# EAGLE design PulseSensorRing (EAGLE 7.3.0)
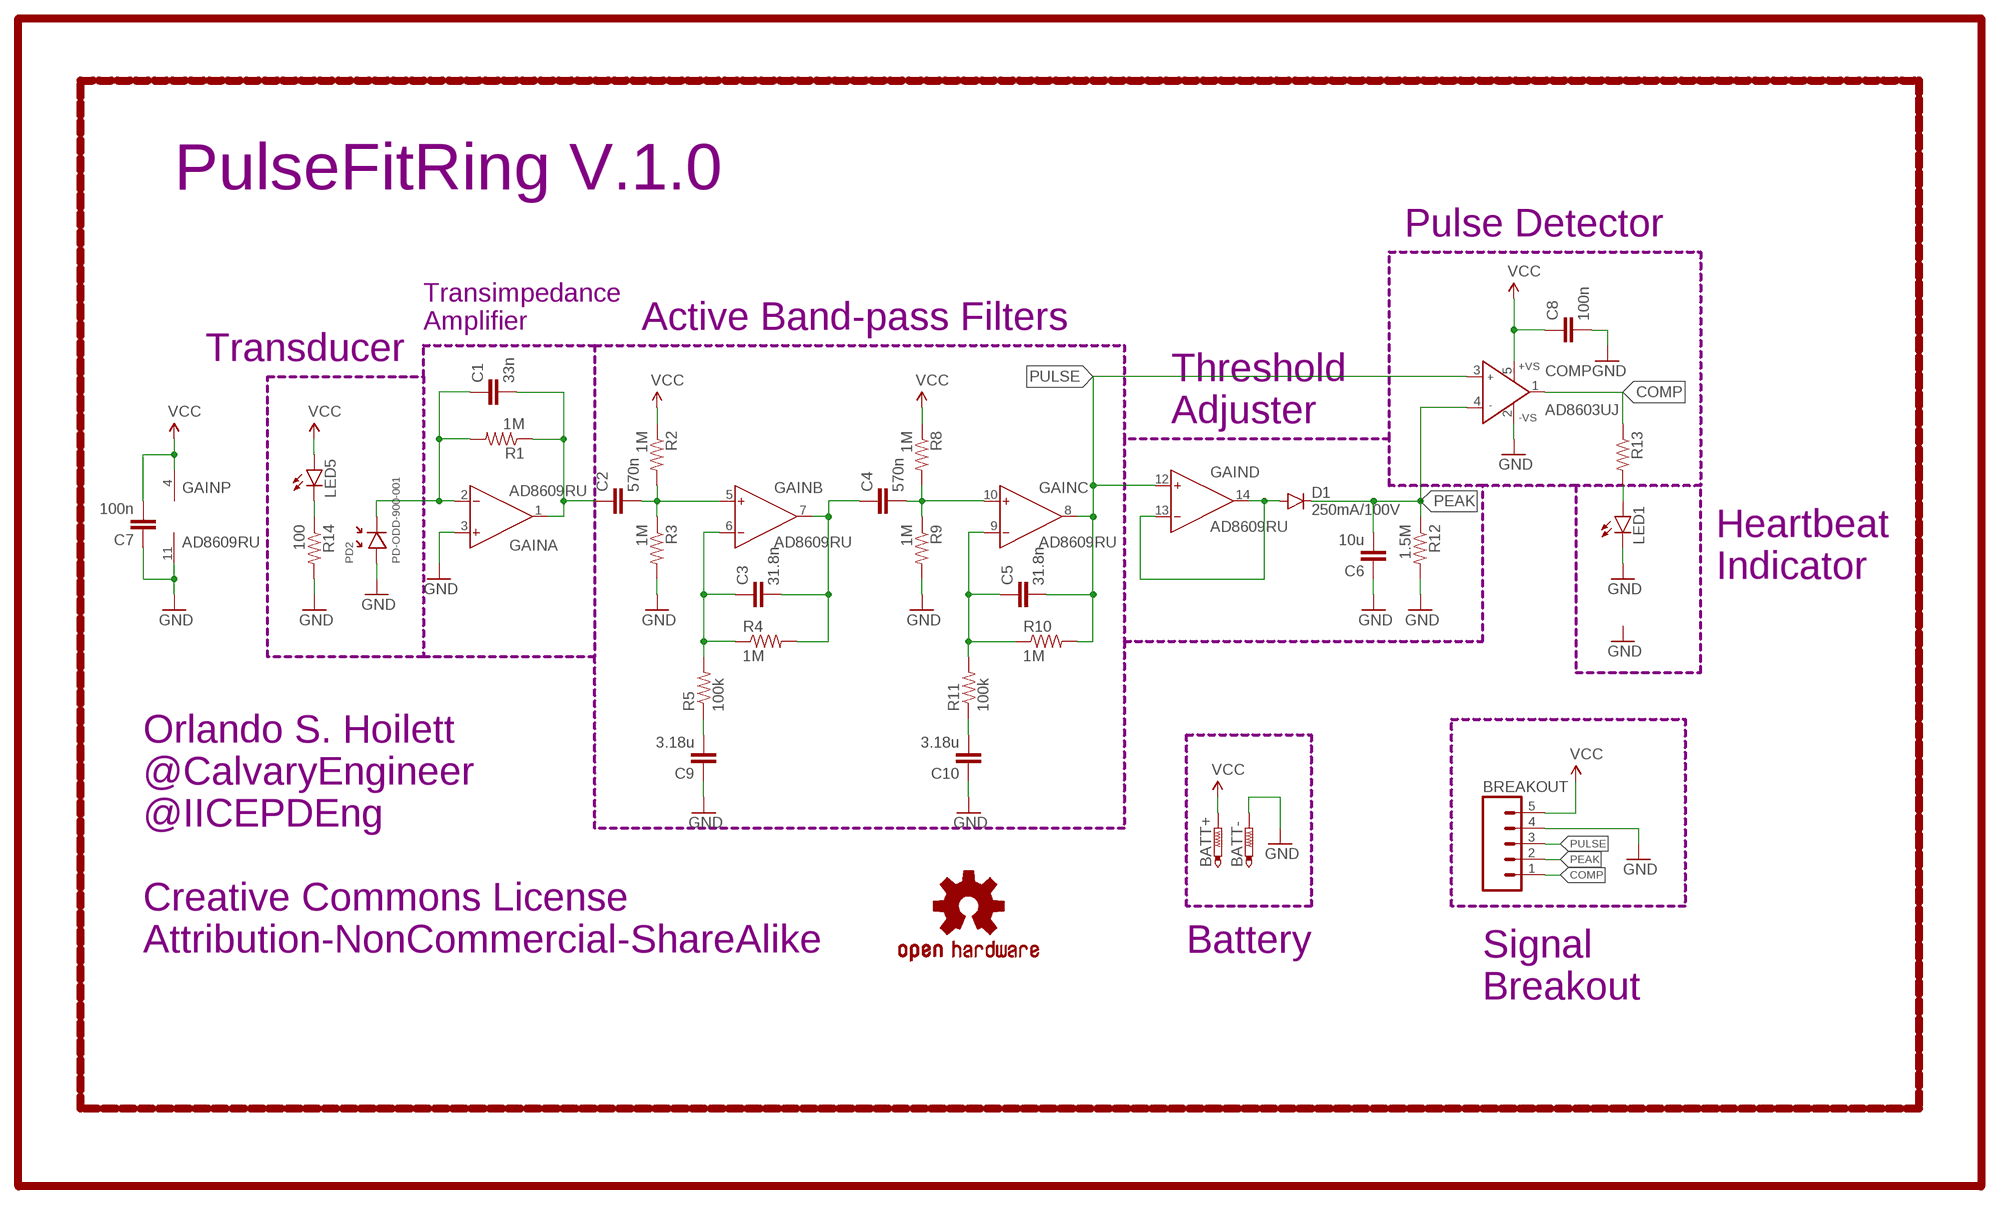
[diagram p0: schematic, sheet 1]

## Parts
BATT  BATT-CONNECT  [HOLE]
BREAKOUT  M05NO_SILK  [1X05_NO_SILK]
C1  33n  C-EUC0402  [C0402]
C2  570n  C-EUC0402  [C0402]
C3  31.8n  C-EUC0402  [C0402]
C4  570n  C-EUC0402  [C0402]
C5  31.8n  C-EUC0402  [C0402]
C6  10u  C-EUC0402  [C0402]
C7  100n  C-EUC0402  [C0402]
C8  100n  C-EUC0402  [C0402]
C9  3.18u  C-EUC0402  [C0402]
C10  3.18u  C-EUC0402  [C0402]
COMP  AD8603UJ  [SOT23-5]
D1  250mA/100V  DIODEBAS16  [SOD-323]
GAIN  AD8609RU  [TSSOP14]
LED1  LED0603  [LED-0603]
LED5  LED0603  [LED-0603]
LOGO1  OSHW-LOGOS  [OSHW-LOGO-S]
PD2  PD-ODD-900-001  [SMD-PD-01]
R1  1M  R-US_R0402  [R0402]
R2  1M  R-US_R0402  [R0402]
R3  1M  R-US_R0402  [R0402]
R4  1M  R-US_R0402  [R0402]
R5  100k  R-US_R0402  [R0402]
R8  1M  R-US_R0402  [R0402]
R9  1M  R-US_R0402  [R0402]
R10  1M  R-US_R0402  [R0402]
R11  100k  R-US_R0402  [R0402]
R12  1.5M  R-US_R0402  [R0402]
R13  R-US_R0402  [R0402]
R14  100  R-US_R0402  [R0402]

## Nets
COMP: BREAKOUT.1 COMP.1(OUT) R13.1
GND: BATT.P$2 BREAKOUT.4 C6.1 C7.1 C8.2 C9.1 C10.1 COMP.2(-VS) GAIN.3(A:IN+) GAIN.11(P:V-) LED1.C PD2.ANODE(+) R3.2 R9.2 R12.2 R14.2
N$1: C1.1 GAIN.2(A:IN-) PD2.CATHODE(-) R1.2
N$2: C1.2 C2.1 GAIN.1(A:OUT) R1.1
N$3: C4.2 GAIN.10(C:IN+) R8.2 R9.1
N$4: C2.2 GAIN.5(B:IN+) R2.2 R3.1
N$5: C3.1 GAIN.6(B:IN-) R4.1 R5.2
N$6: C3.2 C4.1 GAIN.7(B:OUT) R4.2
N$7: C9.2 R5.1
N$8: C5.1 GAIN.9(C:IN-) R10.1 R11.2
N$9: LED5.C R14.1
N$10: D1.A GAIN.13(D:IN-) GAIN.14(D:OUT)
N$11: C10.2 R11.1
N$13: LED1.A R13.2
PEAK: BREAKOUT.2 C6.2 COMP.4(IN-) D1.C R12.1
PULSE: BREAKOUT.3 C5.2 COMP.3(IN+) GAIN.8(C:OUT) GAIN.12(D:IN+) R10.2
VCC: BATT.P$1 BREAKOUT.5 C7.2 C8.1 COMP.5(+VS) GAIN.4(P:V+) LED5.A R2.1 R8.1

## Notes on the sheet
- PulseFitRing V.1.0
- Pulse Detector
- Transimpedance
  Amplifier
- Active Band-pass Filters
- Transducer
- Threshold
  Adjuster
- Heartbeat
  Indicator
- Orlando S. Hoilett
  @CalvaryEngineer
  @IICEPDEng
  
  Creative Commons License
  Attribution-NonCommercial-ShareAlike
- Battery
- Signal
  Breakout

## Library data of the parts
BATT = OrlandoRonMod:BATT-CONNECT
BREAKOUT = SparkFun-Connectors:M05: Header 5 Standard 5-pin 0.1" header. Use with straight break away headers (SKU : PRT-00116), right angle break away headers (PRT-00553), swiss pins (PRT-00743), machine pins (PRT-00117), and female headers (PRT-00115). Molex polarized connector foot print use with SKU : PRT-08230 with associated crimp pins and housings.
C1-C10 = resistor:C-EU: CAPACITOR, European symbol
COMP = analog-devices:AD8603: Precision Micropower, Low Noise CMOS, Rail-to-Rail Input/Output Operational Amplifiers Source: http://www.analog.com/static/imported-files/data_sheets/AD8603_8607_8609.pdf; MF: ALTERA CORPORATION; MPN: AD8603AUJZ-REEL7; OC_FARNELL: 1651290; OC_NEWARK: 59K6904
D1 = SparkFun-DiscreteSemi:DIODE: Diode These are standard reverse protection diodes and small signal diodes. SMA package can handle up to about 1A. SOD-323 can handle about 200mA. What the SOD-323 package when ordering, there are some mfgs out there that are 5-pin packages.; PROD_ID: DIO-09646
GAIN = analog-devices:AD8609: Precision Micropower, Low Noise CMOS, Rail-to-Rail Input/Output Operational Amplifiers Source: http://www.analog.com/static/imported-files/data_sheets/AD8603_8607_8609.pdf; MF: ALTERA CORPORATION; MPN: AD8609ARUZ; OC_FARNELL: 1464994; OC_NEWARK: 59K6934
LED1 LED5 = SparkFun-LED:LED: LEDs Standard schematic elements and footprints for 5mm, 3mm, 1206, and 0603 sized LEDs. 5mm - Spark Fun Electronics SKU : COM-00529 (and others)
LOGO1 = SparkFun-Aesthetics:OSHW-LOGO: Open Source Hardware Logo This logo indicates the piece of hardware it is found on incorporates a OSHW license and/or adheres to the definition of open source hardware found here: http://freedomdefined.org/OSHW
PD2 = Orlando:PD-ODD-900-001
R1-R5 R8-R14 = resistor:R-US_: RESISTOR, American symbol

## Board
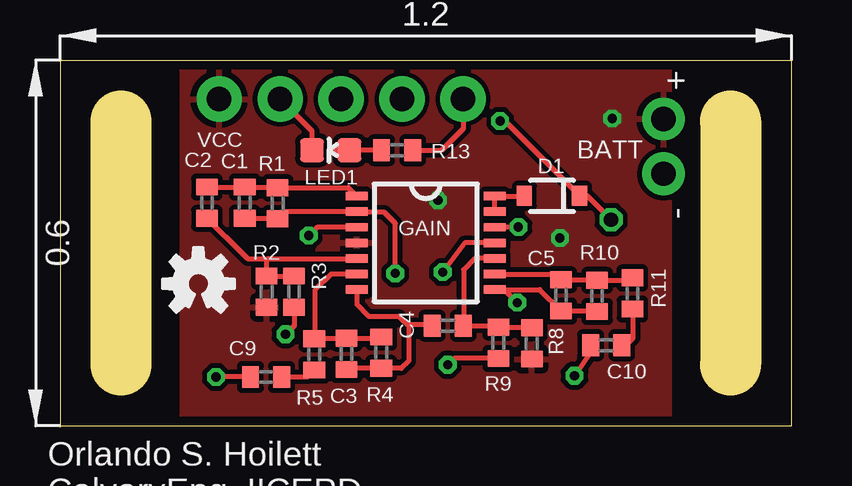
[diagram p1: board, top side]
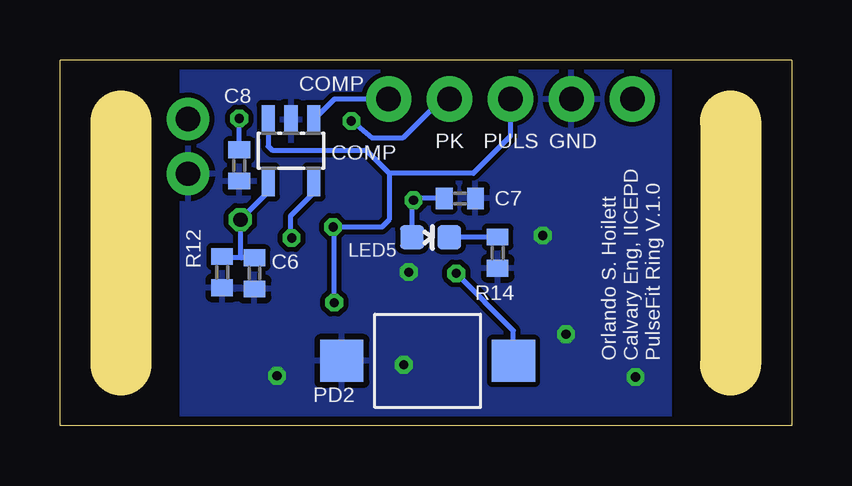
[diagram p2: board, bottom side, seen from below]

Size 30.48 x 15.24 mm. Coordinates in mm from the lower left corner, seen from the top.
Outline: 2.54,12.7 2.54,2.54
Outline: 27.94,12.7 27.94,2.54
Outline: 0,0 30.48,0 30.48,15.24 0,15.24 0,0
Copper layers (1*16): Top 0.0356mm / dielectric 1.5011mm / Bottom 0.0356mm
Design rules "LaenPCBOrder": minimum track width 6mil, minimum drill 13mil, track to track 6mil, track to pad 6mil, pad to pad 6mil, via to via 6mil, smd to smd 6mil, copper to edge 15mil, drill to drill 6mil, minimum pad ring 7mil, minimum via ring 7mil, stop-mask expansion 3mil, vias tented up to drill 0mil, thermal gap 10mil

### Footprints (pad centres in the part's own frame; a part is rotated, then mirrored left to right if it is on the bottom)
HOLE = drill 1.016 pad 1.778: P$1 -1.151,0; P$2 1.135,0
1X05_NO_SILK = drill 1.016 pad 1.88: 1 0,0; 2 2.54,0; 3 5.08,0; 4 7.62,0; 5 10.16,0
C0402 = smd 0.7 x 0.9: 1 -0.65,0; 2 0.65,0
SOT23-5 = smd 0.55 x 1.2: 1 -0.95,-1.3; 2 0,-1.3; 3 0.95,-1.3; 4 0.95,1.3; 5 -0.95,1.3
SOD-323 = smd 0.63 x 0.83: A 1.15,0; C -1.15,0
TSSOP14 = smd 0.9 x 0.35: 1 -2.875,1.95; 2 -2.875,1.3; 3 -2.875,0.65; 4 -2.875,0; 5 -2.875,-0.65; 6 -2.875,-1.3; 7 -2.875,-1.95; 8 2.875,-1.95; 9 2.875,-1.3; 10 2.875,-0.65; 11 2.875,0; 12 2.875,0.65; 13 2.875,1.3; 14 2.875,1.95
LED-0603 = smd 1 x 1: A 0,-0.677; C 0,0.877
SMD-PD-01 = smd 1.8 x 1.75: ANODE -3.575,0; CATHODE 3.575,0
R0402 = smd 0.7 x 0.9: 1 -0.65,0; 2 0.65,0

### Placement (x,y rotation side)
BATT  25.15,11.63 270 top
BREAKOUT  16.79,13.61 180 top
C1  7.7,9.3 90 top
C2  6.12,9.3 270 top
C3  11.94,3 270 top
C4  16.15,4.17 0 top
C5  20.88,5.44 270 top
C6  22.38,6.35 90 bottom
C7  13.82,9.47 180 bottom
C8  23.01,10.85 270 bottom
C9  8.59,2.03 0 top
C10  22.76,3.35 0 top
COMP  20.85,11.46 180 bottom
D1  20.5,9.58 180 top
GAIN  15.24,7.62 0 top
LED1  11.38,11.48 90 top
LED5  15.14,7.85 270 bottom
LOGO1  5.77,5.92 0 top
PD2  15.16,2.71 0 bottom
R1  9.07,9.27 270 top
R2  8.61,5.59 90 top
R3  9.75,5.59 270 top
R4  13.39,3.05 270 top
R5  10.59,2.97 90 top
R8  19.66,3.43 90 top
R9  18.26,3.45 270 top
R10  22.38,5.41 270 top
R11  23.85,5.51 90 top
R12  23.72,6.4 270 bottom
R13  14.05,11.48 180 top
R14  12.24,7.21 270 bottom

### Tracks (layer width: path | path; a pad name or v marks a point on that pad's centre or on a via)
COMP
  Top 0.203: R13.1 15.9,11.48 16.82,12.39 16.82,13.59 BREAKOUT.1
  Bottom 0.203: COMP.1 19.04,13.61 BREAKOUT.1 16.87,13.54
GND  (via drill 0.38)
  Top 0.203: C9.1 v6.5,2.03 | GAIN.3 10.71,8.27 v10.36,7.92 | C10.1 22.11,3.06 v21.44,2.08 | R9.2 16.42,2.8 v16.15,2.54 | GAIN.11 16.87,7.62 v15.95,6.4 | LED1.C 10.5,12.28 BREAKOUT.4 | R3.2 9.75,4.17 v9.4,3.81
  pour Bottom (isolate 0.203): 25.4,15.24 25.4,0 5.08,0 5.08,15.24
N$1  (via drill 0.38)
  Top 0.203: v13.97,6.35 13.97,8.43 13.51,8.89 12.39,8.89 GAIN.2 9.37,8.92 R1.2 7.72,8.62 C1.1
  Bottom 0.203: PD2.CATHODE 11.59,3.97 v13.97,6.35
N$2
  Top 0.203: C2.1 C1.2 9.04,9.95 R1.1 12.01,9.92 GAIN.1
N$3
  Top 0.203: R8.2 19.63,4.1 R9.1 18.2,4.17 C4.2 16.82,4.18 16.82,6.5 17.28,6.97 GAIN.10
N$4
  Top 0.203: C2.2 7.59,7.19 7.82,6.96 8.69,6.96 | 8.69,6.96 12.36,6.96 GAIN.5 | R3.1 R2.2 8.61,6.88 8.69,6.96
N$5
  Top 0.203: GAIN.6 11.3,6.32 10.62,5.64 10.62,3.65 | 10.62,3.65 R5.2 | 10.62,3.65 C3.1 13.34,3.65 R4.1
N$6
  Top 0.203: GAIN.7 12.37,5.06 12.85,4.57 14.12,4.57 14.53,4.17 | 14.53,4.17 14.53,2.69 14.22,2.39 13.4,2.39 R4.2 11.99,2.4 C3.2 | C4.1 15.54,4.21 14.57,4.21 14.53,4.17
N$7
  Top 0.203: C9.2 10.3,2.03 R5.1
N$8
  Top 0.203: GAIN.9 20.64,6.32 C5.1 22.35,6.09 R10.1 23.75,6.06 R11.2
N$9
  Bottom 0.203: R14.1 14.25,7.86 LED5.C
N$10
  Top 0.203: GAIN.13 GAIN.14 D1.A
N$11
  Top 0.203: C10.2 23.42,3.2 23.88,3.66 23.88,4.84 R11.1
N$13
  Top 0.203: R13.2 LED1.A 11.5,11.48
PEAK  (via drill 0.38, 0.6)
  Top 0.203: v22.96,8.59 21.97,9.58 D1.C 18.52,12.7 v18.34,12.7
  Bottom 0.203: C6.2 22.91,7 | 22.91,7 23.67,7 R12.1 | v22.96,8.59 22.96,7.05 22.91,7 | 23.01,8.64 v22.96,8.59 | BREAKOUT.2 14.58,13.61 16.2,11.99 17.48,11.99 v18.34,12.7 | COMP.4 21.8,9.74 v22.96,8.59
PULSE  (via drill 0.38)
  Top 0.203: R10.2 22.35,4.79 C5.2 19.99,5.67 GAIN.8 18.51,5.67 v19.05,5.13 | v19.1,8.28 GAIN.12
  Bottom 0.203: v19.05,5.13 19.05,8.23 v19.1,8.28 17.07,8.28 16.76,8.59 16.76,10.52 | COMP.3 21.8,11.64 21.64,11.48 17.73,11.48 16.76,10.52 | BREAKOUT.3 11.71,12.06 13.26,10.52 16.76,10.52
VCC  (via drill 0.38)
  Bottom 0.203: COMP.5 19.9,9.71 20.88,8.74 20.88,7.87 v20.83,7.82 | LED5.A 15.81,9.33 v15.75,9.4 15.67,9.47 C7.2 | C8.1 v23.01,12.8
  pour Top (isolate 0.203): 5.08,15.24 5.08,0 25.4,0 25.4,15.24

### Text on the board
tSilk: Dimensions are in INCHES | Orlando S. Hoilett / CalvaryEng, IICEPD / / Creative Commons License / Attribution-NonCommercial-ShareAlike 3.0 Unported
_tsilk: VCC
_bsilk: COMP | GND | PULS | PK | Orlando S. Hoilett / Calvary Eng, IICEPD / PulseFit Ring V.1.0